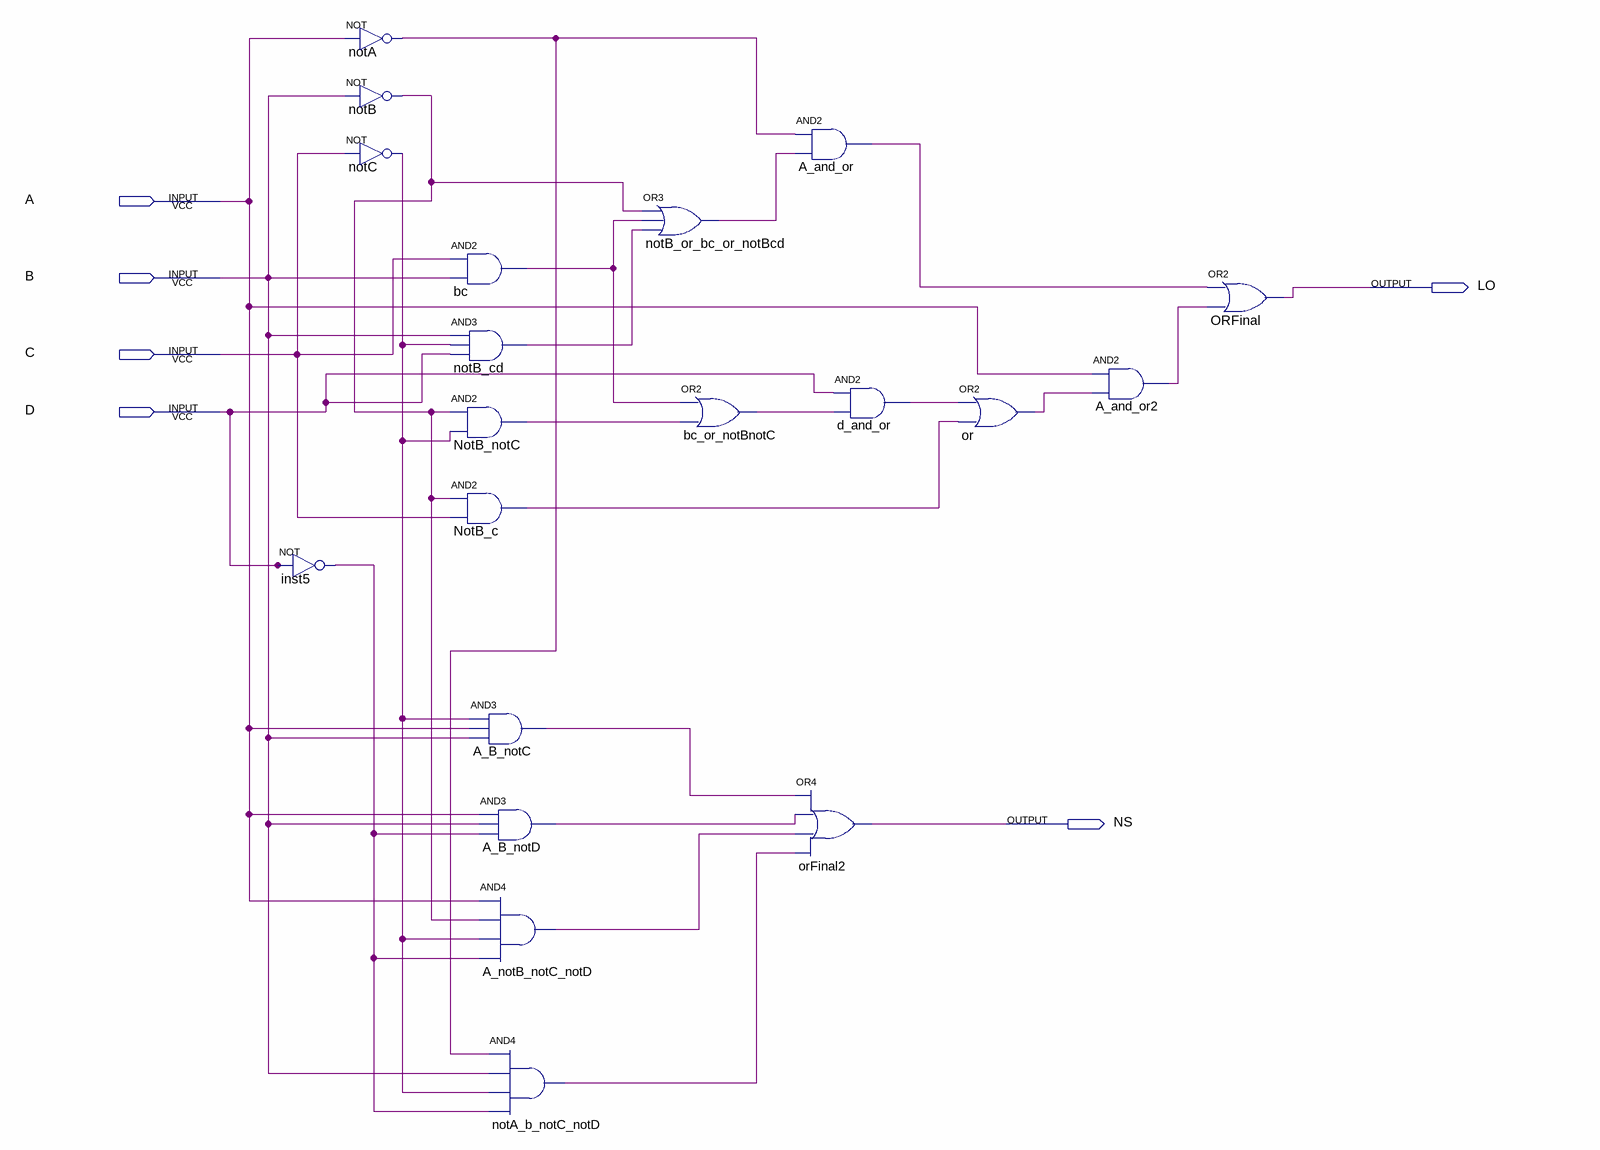
[diagram p0: schematic sheet]
// Quartus schematic teste.bdf as structural Verilog: 20 symbols, 6 pins
module teste (
  input  A,
  input  B,
  input  C,
  input  D,
  output LO,
  output NS
);

  wire A_and_or2_out, A_and_or_out, A_B_notC_out, A_B_notD_out, A_notB_notC_notD_out, bc_or_notBnotC_out,
       bc_out, d_and_or_out, inst5_out, notA_b_notC_notD_out, notA_out, NotB_c_out, notB_cd_out,
       NotB_notC_out, notB_or_bc_or_notBcd_out, notB_out, notC_out, or_out;

  not inst5 (inst5_out, D);
  not notA (notA_out, A);
  not notB (notB_out, B);
  not notC (notC_out, C);
  and bc (bc_out, C, B);
  and notB_cd (notB_cd_out, B, notC_out, D);
  and NotB_notC (NotB_notC_out, notB_out, notC_out);
  and NotB_c (NotB_c_out, notB_out, C);
  and A_B_notC (A_B_notC_out, notC_out, A, B);
  and A_B_notD (A_B_notD_out, A, B, inst5_out);
  and A_notB_notC_notD (A_notB_notC_notD_out, A, notB_out, notC_out, inst5_out);
  and notA_b_notC_notD (notA_b_notC_notD_out, notA_out, B, notC_out, inst5_out);
  or notB_or_bc_or_notBcd (notB_or_bc_or_notBcd_out, notB_out, bc_out, notB_cd_out);
  or bc_or_notBnotC (bc_or_notBnotC_out, bc_out, NotB_notC_out);
  and A_and_or (A_and_or_out, notA_out, notB_or_bc_or_notBcd_out);
  and d_and_or (d_and_or_out, D, bc_or_notBnotC_out);
  or orFinal2 (NS, A_B_notC_out, A_B_notD_out, A_notB_notC_notD_out, notA_b_notC_notD_out);
  or \or  (or_out, d_and_or_out, NotB_c_out);
  and A_and_or2 (A_and_or2_out, A, or_out);
  or ORFinal (LO, A_and_or_out, A_and_or2_out);
endmodule
